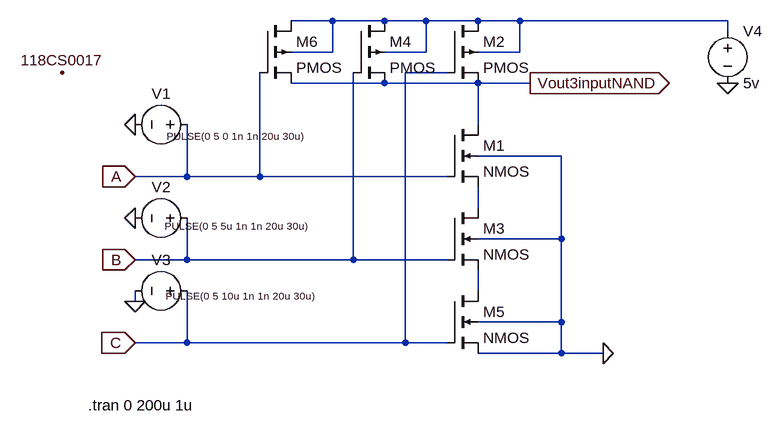
[diagram p0: schematic Draft3.asc]
Draft3.asc, the LTspice schematic file:
Version 4
SHEET 1 880 680
WIRE -48 -32 -112 -32
WIRE 32 -32 -48 -32
WIRE 96 -32 32 -32
WIRE 176 -32 96 -32
WIRE 240 -32 176 -32
WIRE 560 -32 240 -32
WIRE 560 -16 560 -32
WIRE -48 16 -48 -32
WIRE -48 16 -112 16
WIRE 96 16 96 -32
WIRE 96 16 32 16
WIRE 240 16 240 -32
WIRE 240 16 176 16
WIRE 128 48 64 48
WIRE 32 64 -112 64
WIRE 176 64 32 64
WIRE 256 64 176 64
WIRE 176 128 176 64
WIRE 304 176 176 176
WIRE -272 208 -272 128
WIRE -272 208 -352 208
WIRE -160 208 -160 48
WIRE -160 208 -272 208
WIRE 128 208 -160 208
WIRE 176 256 176 224
WIRE 304 304 304 176
WIRE 304 304 176 304
WIRE -272 336 -272 272
WIRE -272 336 -352 336
WIRE -16 336 -16 48
WIRE -16 336 -272 336
WIRE 128 336 -16 336
WIRE 176 384 176 352
WIRE -352 400 -352 384
WIRE 304 432 304 304
WIRE 304 432 176 432
WIRE -272 464 -272 384
WIRE -272 464 -352 464
WIRE 64 464 64 48
WIRE 64 464 -272 464
WIRE 128 464 64 464
WIRE 304 480 304 432
WIRE 304 480 176 480
WIRE 368 480 304 480
FLAG -352 208 A
IOPIN -352 208 In
FLAG -352 336 B
IOPIN -352 336 In
FLAG -352 464 C
IOPIN -352 464 In
FLAG 256 64 Vout3inputNAND
IOPIN 256 64 Out
FLAG 368 480 0
FLAG -352 128 0
FLAG -352 272 0
FLAG -352 400 0
FLAG 560 64 0
FLAG -464 48 118CS0017
SYMBOL nmos4 128 128 R0
SYMATTR InstName M1
SYMBOL pmos4 128 -32 R0
SYMATTR InstName M2
SYMBOL nmos4 128 256 R0
SYMATTR InstName M3
SYMBOL pmos4 -16 -32 R0
SYMATTR InstName M4
SYMBOL nmos4 128 384 R0
SYMATTR InstName M5
SYMBOL pmos4 -160 -32 R0
SYMATTR InstName M6
SYMBOL voltage -256 128 R90
WINDOW 0 -32 56 VBottom 2
WINDOW 3 7 -56 VTop 1
WINDOW 123 0 0 Left 0
WINDOW 39 0 0 Left 0
SYMATTR InstName V1
SYMATTR Value PULSE(0 5 0 1n 1n 20u 30u)
SYMBOL voltage -256 272 R90
WINDOW 0 -32 56 VBottom 2
WINDOW 3 2 -58 VTop 1
WINDOW 123 0 0 Left 0
WINDOW 39 0 0 Left 0
SYMATTR InstName V2
SYMATTR Value PULSE(0 5 5u 1n 1n 20u 30u)
SYMBOL voltage -256 384 R90
WINDOW 0 -32 56 VBottom 2
WINDOW 3 -3 -64 VTop 1
WINDOW 123 0 0 Left 0
WINDOW 39 0 0 Left 0
SYMATTR InstName V3
SYMATTR Value PULSE(0 5 10u 1n 1n 20u 30u)
SYMBOL voltage 560 -32 R0
WINDOW 123 0 0 Left 0
WINDOW 39 0 0 Left 0
SYMATTR InstName V4
SYMATTR Value 5v
TEXT -424 560 Left 2 !.tran 0 200u 1u

The netlist it stands for:
* Draft3.asc
M1 Vout3inputNAND A N002 0 NMOS
M2 N001 C Vout3inputNAND N001 PMOS
M3 N002 B N003 0 NMOS
M4 N001 B Vout3inputNAND N001 PMOS
M5 N003 C 0 0 NMOS
M6 N001 A Vout3inputNAND N001 PMOS
V1 A 0 PULSE(0 5 0 1n 1n 20u 30u)
V2 B 0 PULSE(0 5 5u 1n 1n 20u 30u)
V3 C 0 PULSE(0 5 10u 1n 1n 20u 30u)
V4 N001 0 5v
.model NMOS NMOS
.model PMOS PMOS
.lib standard.mos
.tran 0 200u 1u
.backanno
.end